# EasyEDA Pro project Example_Coloful Silkscreen Design.eprj

# Board JLCPCB Bear_V-CUT Panelize
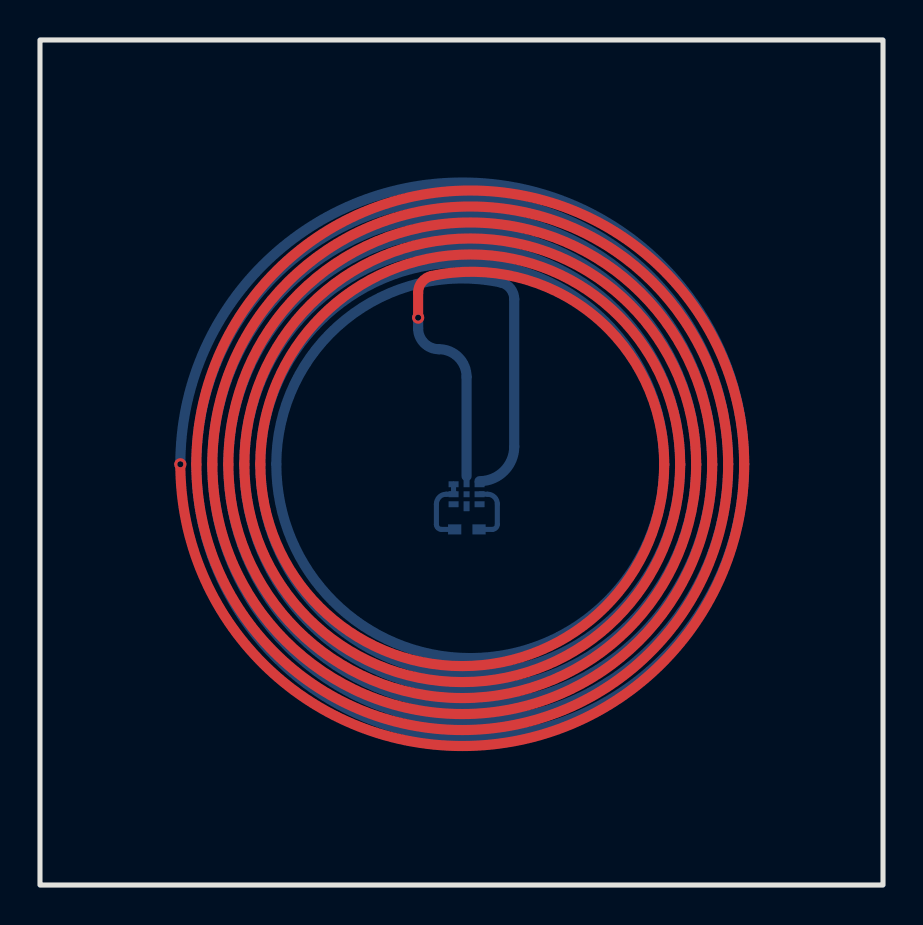
[diagram p0: board, top side]
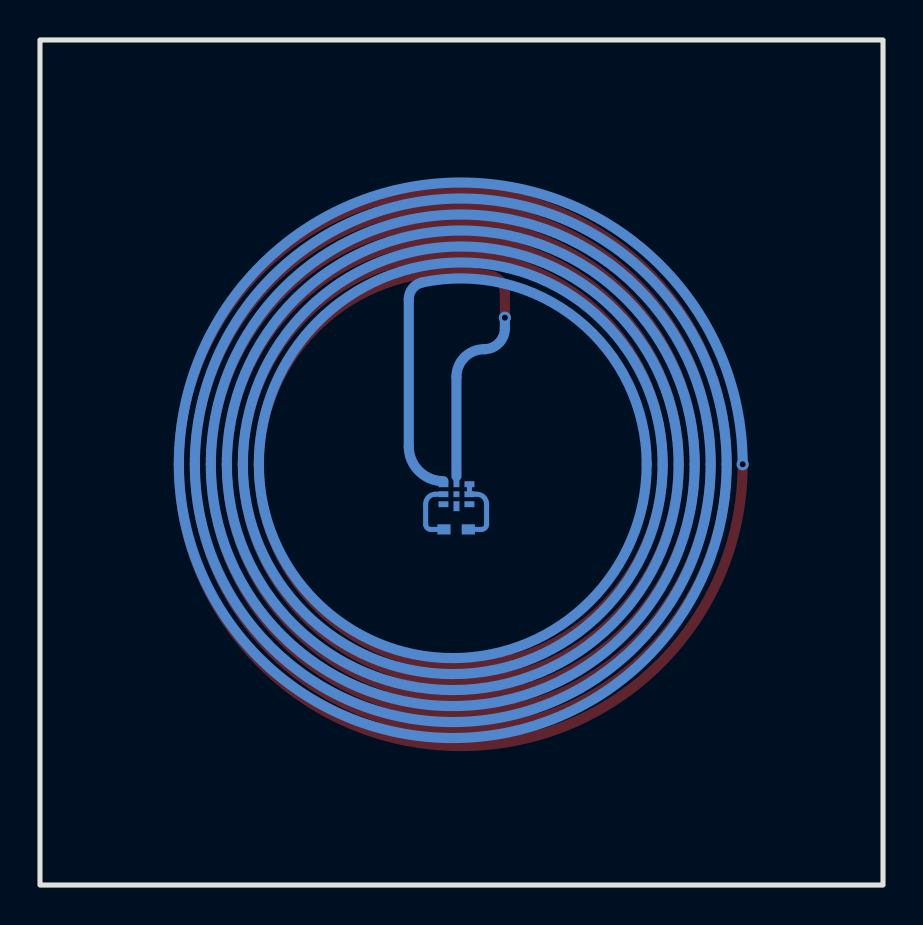
[diagram p1: board, bottom side, seen from below]

Outline 42.16 x 42.29 mm; copper layers: Top Layer, Bottom Layer. Coordinates in mm from the lower left corner of the outline.
Outline path: rectangle 0,42.29 42.16,0
Stack: Top Layer 0.035mm / Dielectric1 1.51mm FR4 er 4.5 / Bottom Layer 0.035mm

## Design rules (mm)
spacing Default (default): track to track 0.152, other pairs 0 to 0.152
track width Default (default): min 0.254, default 0.254, max 25.4
differential pair differentialPair (default): width min 0.127, default 0.254, max 2.54; gap min 0.152, default 0.152
via Default (default): diameter min 0.61, default 0.61, max 100.025; hole min 0.305, default 0.305, max 59.995

## Placement (name value [footprint] x y rotation side)
C1  0.1uF  [C 0402_M]  21.35 17.8 180 bottom
U1  NT3H1101W0FHKH  [XQFN-8_L1.6-W1.6-P0.50-BR]  21.34 19.56 0 bottom

## Footprints (pads in the part's own frame, mm; a bottom-side part is the same pattern mirrored in y, then rotated)
C 0402_M
  rect 0.66x0.508 smd: 1(-0.61,0) 2(0.61,0)
XQFN-8_L1.6-W1.6-P0.50-BR
  rect 0.5x0.3 smd: 1(0.65,-0.5) 2(0.65,0) 3(0.65,0.5) 5(-0.65,0.5) 6(-0.65,0) 7(-0.65,-0.5)
  rect 0.3x0.5 smd: 4(0,0.6) 8(0,-0.6)
  rect 0.3x0.3 smd: 9(0,0)

## Nets
U1_1: U1.1
U1_2: C1.1 U1.2
U1_6: C1.2 U1.6 U1.7
U1_8: U1.8

Pads without a net: U1 3 4 5 9

## Via types
v1: diameter 0.61, hole 0.305, Top Layer to Bottom Layer, 2 vias

## Routing (per net, layer and track width the routed paths; a pad name or vN(x,y) marks a point on that pad's centre or on a via; arc(x,y) is an arc through that point)
U1_1: length 476.4
  Bottom Layer w0.508: 7.02,21.06 arc(21.12,35.16) 35.22,21.06 arc(21.52,7.36) 7.82,21.06 arc(21.12,34.36) 34.42,21.06 arc(21.52,8.16) 8.62,21.06 arc(21.12,33.56) 33.62,21.06 arc(21.52,8.96) 9.42,21.06 arc(21.12,32.76) 32.82,21.06 arc(21.52,9.76) 10.22,21.06 arc(21.12,31.96) 32.02,21.06 arc(21.52,10.56) 11.02,21.06 arc(21.12,31.16) 31.22,21.06 arc(21.52,11.36) 11.82,21.06 arc(15.27,28.28) 23.05,30.16 arc(23.53,29.85) 23.72,29.32 23.72,21.94 arc(23.21,20.72) 21.99,20.21
U1_2: length 3.2
  Bottom Layer w0.254: 21.99,19.56 22.38,19.56 arc(22.73,19.41) 22.87,19.07 22.87,18.05 arc(22.8,17.87) 22.62,17.8 C1.1
U1_6: length 3.7
  Bottom Layer w0.254: C1.2 20.08,17.8 arc(19.9,17.87) 19.83,18.05 19.83,19.07 arc(19.97,19.41) 20.32,19.56 U1.6 U1.7
U1_8: length 447
  Top Layer w0.508: v1(7.02,21.06) arc(21.12,6.96) 35.22,21.06 arc(21.52,34.76) 7.82,21.06 arc(21.12,7.76) 34.42,21.06 arc(21.52,33.96) 8.62,21.06 arc(21.12,8.56) 33.62,21.06 arc(21.52,33.16) 9.42,21.06 arc(21.12,9.36) 32.82,21.06 arc(21.52,32.36) 10.22,21.06 arc(21.12,10.16) 32.02,21.06 arc(21.52,31.56) 11.02,21.06 arc(21.12,10.96) 31.22,21.06 arc(27.65,28.54) 19.58,30.48 arc(19.1,30.18) 18.91,29.64 v1(18.91,28.39)
  Bottom Layer w0.508: 21.34,25.43 arc(20.93,26.41) 19.95,26.81 arc(19.22,27.12) 18.91,27.85 v1(18.91,28.39) ; 21.33,25.43 21.33,20.46

# Board JLCPCB Bear_Stamp Hole Panelize
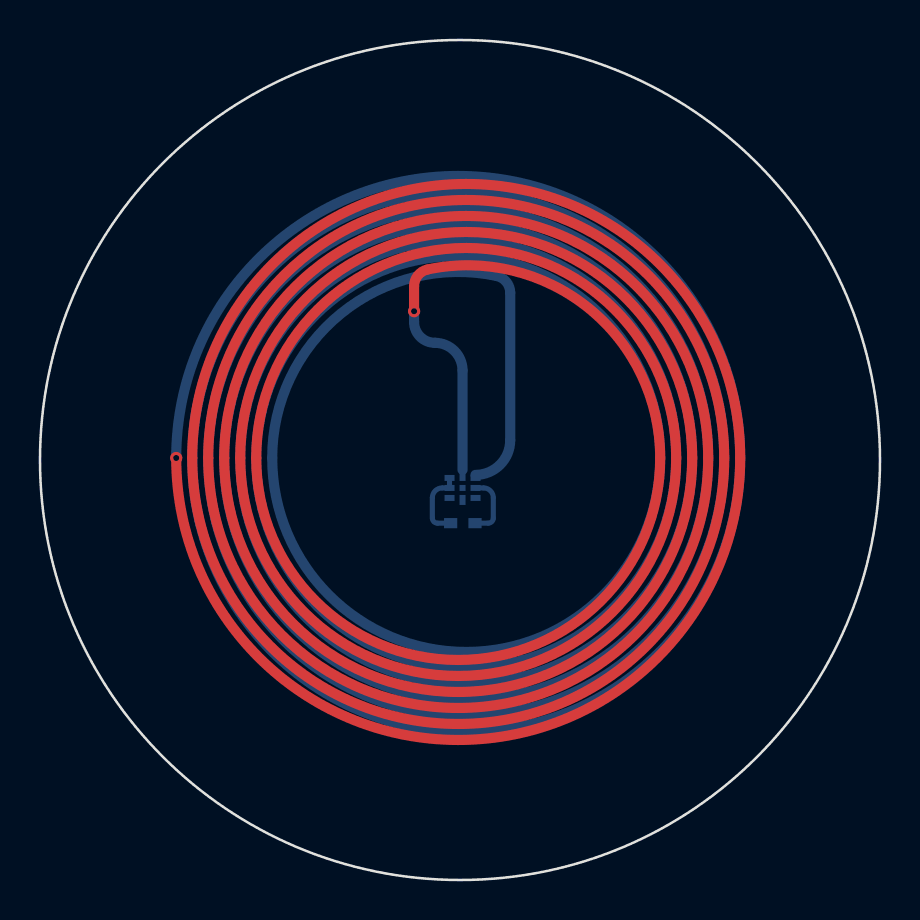
[diagram p2: board, top side]
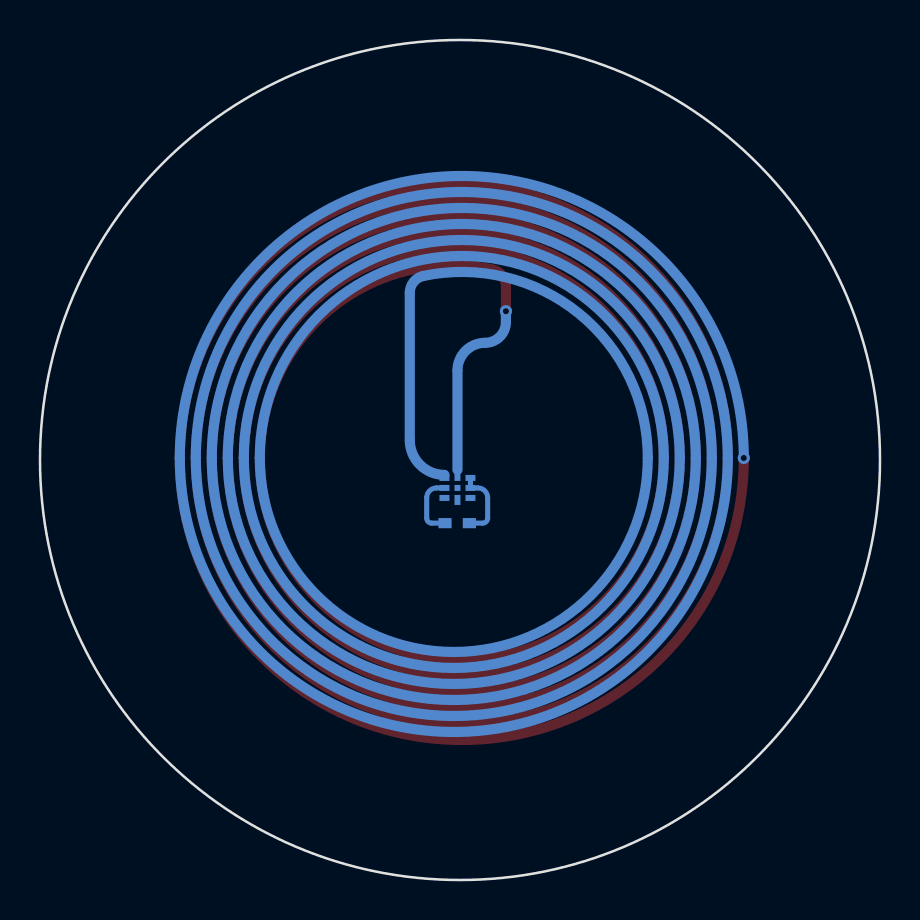
[diagram p3: board, bottom side, seen from below]

Outline 42 x 42 mm; copper layers: Top Layer, Bottom Layer. Coordinates in mm from the lower left corner of the outline.
Outline path: circle c21,21 r21
Stack: Top Layer 0.035mm - / Dielectric1 1.51mm FR4 er 4.5 / Bottom Layer 0.035mm -

## Design rules (mm)
spacing Default (default): track to track 0.152, other pairs 0 to 0.152
track width Default (default): min 0.254, default 0.254, max 25.4
differential pair differentialPair (default): width min 0.127, default 0.254, max 2.54; gap min 0.152, default 0.152
via Default (default): diameter min 0.61, default 0.61, max 100.025; hole min 0.305, default 0.305, max 59.995

## Placement (name value [footprint] x y rotation side)
C1  100nF  [c 0402_m]  21.14 17.84 180 bottom
U1  -  [xqfn-8_l1.6-w1.6-p0.50-br]  21.13 19.6 0 bottom

## Footprints (pads in the part's own frame, mm; a bottom-side part is the same pattern mirrored in y, then rotated)
c 0402_m
  rect 0.66x0.508 smd: 1(-0.61,0) 2(0.61,0)
xqfn-8_l1.6-w1.6-p0.50-br
  rect 0.5x0.3 smd: 1(0.65,-0.5) 2(0.65,0) 3(0.65,0.5) 5(-0.65,0.5) 6(-0.65,0) 7(-0.65,-0.5)
  rect 0.3x0.5 smd: 4(0,0.6) 8(0,-0.6)
  rect 0.3x0.3 smd: 9(0,0)

## Nets
U1_1: U1.1
U1_2: C1.1 U1.2
U1_6: C1.2 U1.6 U1.7
U1_8: U1.8

Pads without a net: U1 3 4 5 9

## Via types
v1: diameter 0.61, hole 0.305, Top Layer to Bottom Layer, 2 vias

## Routing (per net, layer and track width the routed paths; a pad name or vN(x,y) marks a point on that pad's centre or on a via; arc(x,y) is an arc through that point)
U1_1: length 476.4
  Bottom Layer w0.508: 6.81,21.1 arc(20.91,35.2) 35.01,21.1 arc(21.31,7.4) 7.61,21.1 arc(20.91,34.4) 34.21,21.1 arc(21.31,8.2) 8.41,21.1 arc(20.91,33.6) 33.41,21.1 arc(21.31,9) 9.21,21.1 arc(20.91,32.8) 32.61,21.1 arc(21.31,9.8) 10.01,21.1 arc(20.91,32) 31.81,21.1 arc(21.31,10.6) 10.81,21.1 arc(20.91,31.2) 31.01,21.1 arc(21.31,11.4) 11.61,21.1 ; 11.61,21.1 arc(15.06,28.33) 22.84,30.2 arc(23.32,29.9) 23.51,29.36 23.51,21.99 arc(23,20.76) 21.78,20.26
U1_2: length 3.2
  Bottom Layer w0.254: U1.2 22.17,19.6 arc(22.52,19.46) 22.67,19.11 22.67,18.1 arc(22.59,17.92) 22.41,17.84 C1.1
U1_6: length 3.7
  Bottom Layer w0.254: U1.7 U1.6 20.11,19.6 arc(19.76,19.46) 19.62,19.11 19.62,18.1 arc(19.69,17.92) 19.87,17.84 C1.2
U1_8: length 447
  Top Layer w0.508: v1(6.81,21.1) arc(20.91,7) 35.01,21.1 arc(21.31,34.8) 7.61,21.1 arc(20.91,7.8) 34.21,21.1 arc(21.31,34) 8.41,21.1 arc(20.91,8.6) 33.41,21.1 arc(21.31,33.2) 9.21,21.1 arc(20.91,9.4) 32.61,21.1 arc(21.31,32.4) 10.01,21.1 arc(20.91,10.2) 31.81,21.1 arc(21.31,31.6) 10.81,21.1 arc(20.91,11) 31.01,21.1 arc(27.44,28.59) 19.37,30.53 arc(18.89,30.22) 18.7,29.69 v1(18.7,28.44)
  Bottom Layer w0.508: 21.13,25.48 arc(20.72,26.45) 19.74,26.86 arc(19.01,27.16) 18.7,27.9 v1(18.7,28.44) ; 21.13,25.48 21.13,20.51

## Text on the board
Document Layer: About Manufacturing | 1.If your colorful silkscreen boards need JLCPCB SMT service, please make sure you have / set the Technology Side at "Panelize" feature(Type: V-Cut, Number: 1x1, Create Technology Side: Yes, / the panelized size length or width must large than 7mm) or add Technology Side by manually, / otherwise, the colorful silkscreen will not be printed if you choose the SMT service. / 2.Colorful silkscreen doesn't support to panelize more then 1x1 yet, the panelize feature will / not copy the colorful silkscreen, the exported Gerber only one board has colorful image silkscreen. / 3.The more information for colorful silkscreen design and manufacturing, please refer at:Colorful silkscreen tutorial | 1. In the top menu - Settings - PCB - General, enable the Using JLC color silkscreen technology | 2. In the placement menu - image, select the color picture to be placed | 3. You can also click on a footprint and set the color silk screen color of this footprint in the properties panel | 4. When generating Gerber, you will bring a color picture file and place an order in JLCPCB
